# EAGLE design 1chMD (EAGLE 9.4.2)
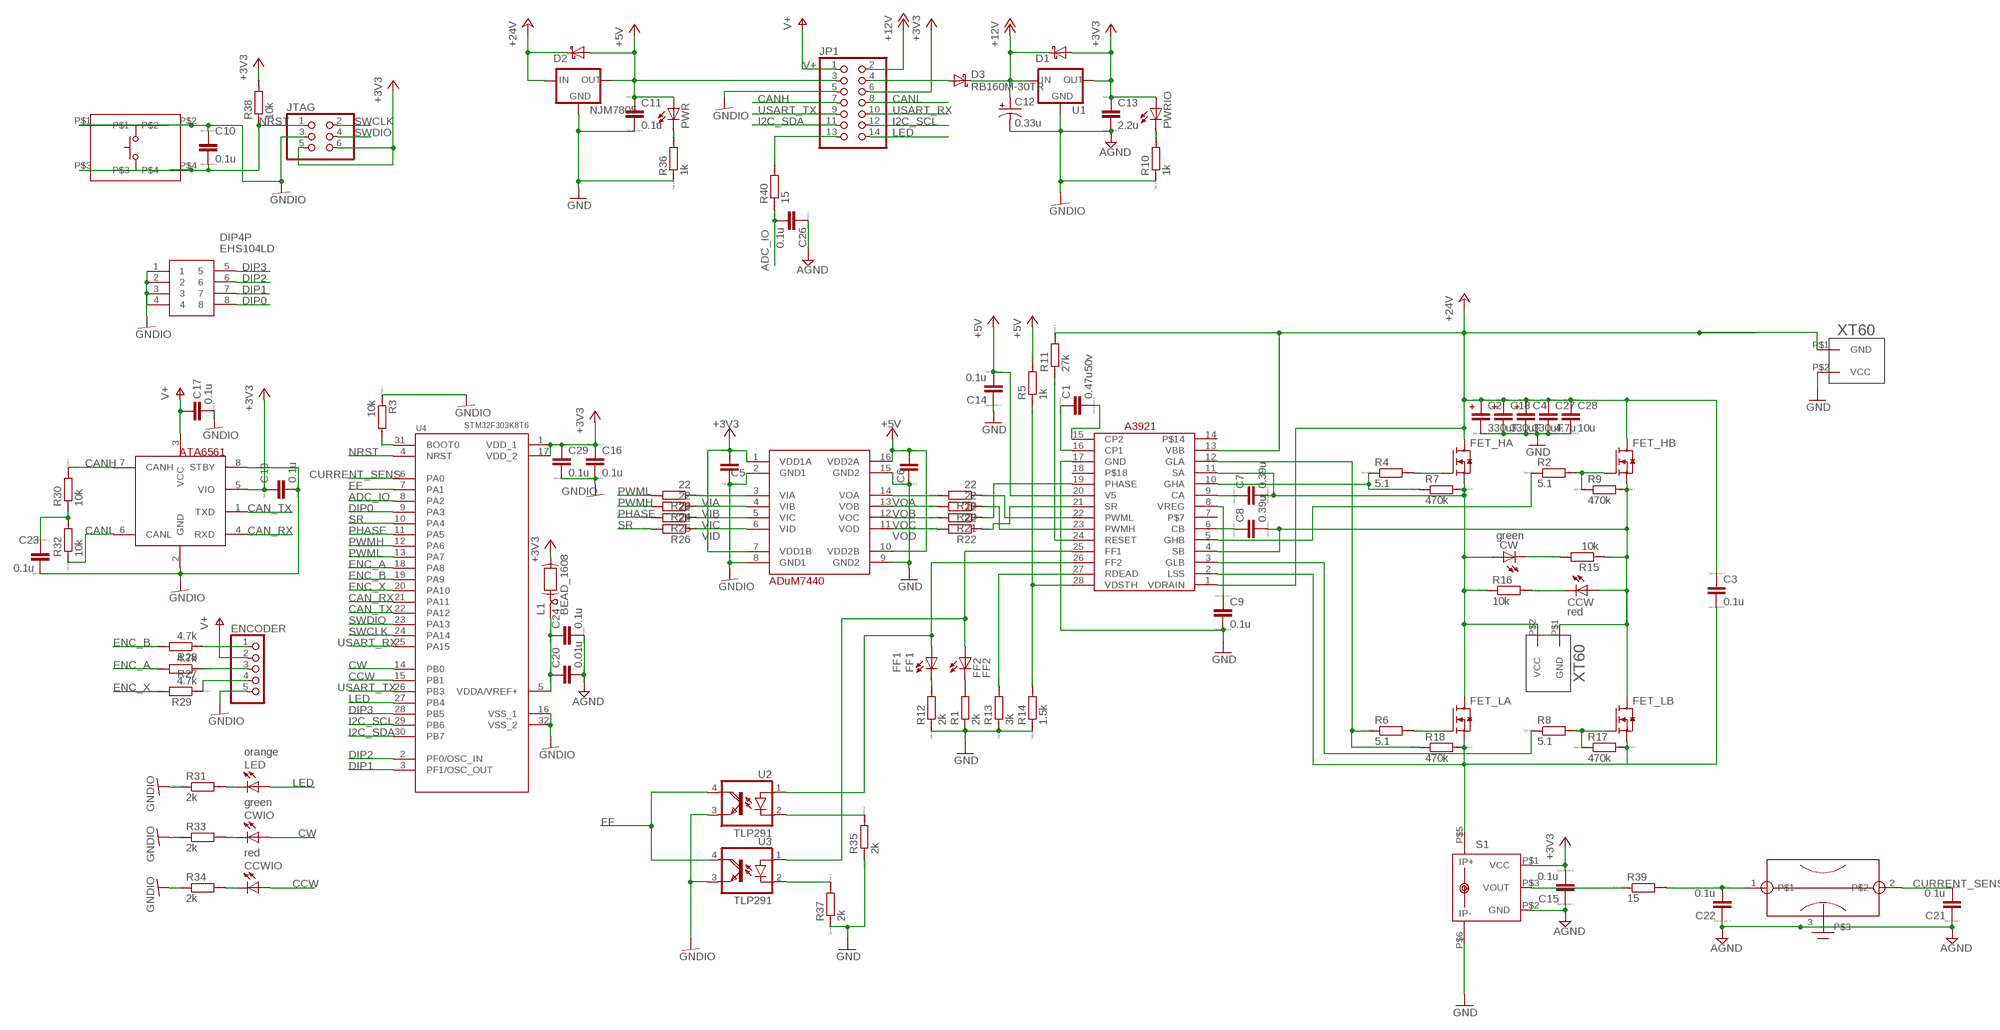
[diagram p0: schematic, sheet 1]

## Parts
A3921  A3921  [TSSOP28]
ADUM7440  ADUM7440  [QSOP16]
ATA6561  ATA6561  [SO_8]
C1  0.47u50v  C_1608  [1608]
C2  330uF  C_D10_SMD  [PANASONIC_G]
C3  0.1u  C_1608  [1608]
C4  330uF  C_D10_SMD  [PANASONIC_G]
C5  C_1608  [1608]
C6  C_1608  [1608]
C7  0.39u  C_1608  [1608]
C8  0.39u  C_1608  [1608]
C9  0.1u  C_1608  [1608]
C10  0.1u  C_1608  [1608]
C11  0.1u  C_1608  [1608]
C12  0.33u  CAP_POLC  [PANASONIC_C]
C13  2.2u  C_1608  [1608]
C14  0.1u  C_1608  [1608]
C15  0.1u  C_1608  [1608]
C16  0.1u  C_1608  [1608]
C17  0.1u  C_1608  [1608]
C18  330uF  C_D10_SMD  [PANASONIC_G]
C19  0.1u  C_1608  [1608]
C20  0.01u  C_1608  [1608]
C21  0.1u  C_1608  [1608]
C22  0.1u  C_1608  [1608]
C23  0.1u  C_1608  [1608]
C24  0.1u  C_1608  [1608]
C25  NFM18PS474R0J3D  [1608_EMIFIL]
C26  0.1u  C_1608  [1608]
C27  4.7u  C_2012  [C0805K]
C28  10u  C_3225  [C1210K]
C29  0.1u  C_1608  [1608]
CCW  red  LED_1608  [1608_POLE]
CCWIO  red  LED_1608  [1608_POLE]
CW  green  LED_1608  [1608_POLE]
CWIO  green  LED_1608  [1608_POLE]
D1  RB751S-40  [1608_POLE]
D2  RB751S-40  [1608_POLE]
D3  RB160M-30TR  [SODFL260X160X90L70X90N]
DIP4P  EHS104LD  [EHS104LD]
ENCODER  PINHD-1X5/90  [1X05/90]
FET_HA  FDBL86561_F085  [PG-HSOF-8-1]
FET_HB  FDBL86561_F085  [PG-HSOF-8-1]
FET_LA  FDBL86561_F085  [PG-HSOF-8-1]
FET_LB  FDBL86561_F085  [PG-HSOF-8-1]
FF1  FF1  LED_1608  [1608_POLE]
FF2  FF2  LED_1608  [1608_POLE]
JP1  PINHD-2X7/90  [2X07/90]
JTAG  PINHD-2X3/90  [2X03/90]
L1  BEAD_1608  [1608]
LED  orange  LED_1608  [1608_POLE]
NJM7805  NJM7805SDL1  [TO252]
P2  XT60-SMD  [XT60-ANGLED]
P4  XT60-SMD  [XT60-ANGLED]
PWR  LED_1608  [1608_POLE]
PWRIO  LED_1608  [1608_POLE]
R1  2k  R_1608  [1608]
R2  5.1  R_1608  [1608]
R3  10k  R_1608  [1608]
R4  5.1  R_1608  [1608]
R5  1k  R_1608  [1608]
R6  5.1  R_1608  [1608]
R7  470k  R_1608  [1608]
R8  5.1  R_1608  [1608]
R9  470k  R_1608  [1608]
R10  1k  R_1608  [1608]
R11  27k  R_1608  [1608]
R12  2k  R_1608  [1608]
R13  3k  R_1608  [1608]
R14  1.5k  R_1608  [1608]
R15  10k  R_1608  [1608]
R16  10k  R_1608  [1608]
R17  470k  R_1608  [1608]
R18  470k  R_1608  [1608]
R19  22  R_1608  [1608]
R20  22  R_1608  [1608]
R21  22  R_1608  [1608]
R22  22  R_1608  [1608]
R23  22  R_1608  [1608]
R24  22  R_1608  [1608]
R25  22  R_1608  [1608]
R26  22  R_1608  [1608]
R27  4.7k  R_1608  [1608]
R28  4.7k  R_1608  [1608]
R29  4.7k  R_1608  [1608]
R30  10k  R_1608  [1608]
R31  2k  R_1608  [1608]
R32  10k  R_1608  [1608]
R33  2k  R_1608  [1608]
R34  2k  R_1608  [1608]
R35  2k  R_1608  [1608]
R36  1k  R_1608  [1608]
R37  2k  R_1608  [1608]
R38  10k  R_1608  [1608]
R39  15  R_1608  [1608]
R40  15  R_1608  [1608]
S1  ACS781KLRTR-150U-T  [7-PIN_PSOF]
SW1  SKRPACE010  [SKRPACE010]
U1  NJM2845  [TO252]
U2  TLP291  [SOIC127P265X700X230-4N]
U3  TLP291  [SOIC127P265X700X230-4N]
U4  STM32F303K8T6  [QFP80P900X900X160-32N]

## Nets
+3V3: ADUM7440.1(VDD1A) ADUM7440.7(VDD1B) ATA6561.5(VIO) C5.1 C13.1 C15.2 C16.1 C19.1 C29.1 D1.2(A) JP1.6 JTAG.5 JTAG.6 L1.2 PWRIO.2(A) R38.2 S1.P$1(VCC) U1.2(OUT) U4.1(VDD_1) U4.17(VDD_2)
+5V: A3921.20(V5) ADUM7440.10(VDD2B) ADUM7440.16(VDD2A) C6.2 C11.1 C14.2 D2.2(A) JP1.3 NJM7805.2(OUT) PWR.2(A) R5.2
+12V: C12.+ D1.1(C) D3.2(C) JP1.2 U1.1(IN)
+24V: A3921.1(VDRAIN) A3921.13(VBB) C2.+ C3.1 C4.+ C18.+ C27.1 C28.1 D2.1(C) FET_HA.9(D) FET_HB.9(D) NJM7805.1(IN) P2.P$1(GND) R11.2
ADC_IO: C26.2 R40.1 U4.8(PA2)
AGND: C12.- C13.2 C15.1 C20.2 C21.1 C22.1 C24.2 C25.3 C26.1 R10.1 S1.P$2(GND) U1.3(GND) ; supply symbol labelled GNDIO
CAN_RX: ATA6561.4(RXD) U4.21(PA11)
CAN_TX: ATA6561.1(TXD) U4.22(PA12)
CANH: ATA6561.7(CANH) JP1.7 R30.2
CANL: ATA6561.6(CANL) JP1.8 R32.1
CCW: CCWIO.2(A) U4.15(PB1)
CURRENT_SENS: C21.2 C25.2 U4.6(PA0)
CW: CWIO.2(A) U4.14(PB0)
DIP0: DIP4P.8 U4.9(PA3)
DIP1: DIP4P.7 U4.3(PF1/OSC_OUT)
DIP2: DIP4P.6 U4.2(PF0/OSC_IN)
DIP3: DIP4P.5 U4.28(PB5)
ENC_A: R27.2 U4.18(PA8)
ENC_B: R28.2 U4.19(PA9)
ENC_X: R29.2 U4.20(PA10)
FF: U2.4(COL) U3.4(COL) U4.7(PA1)
GND: A3921.17(GND) ADUM7440.9(GND2) ADUM7440.15(GND2) C2.- C4.- C6.1 C9.2 C11.2 C14.1 C18.- C27.2 C28.2 NJM7805.3(GND) P2.P$2(VCC) R1.1 R12.1 R13.1 R14.1 R35.1 R36.1 R37.1 S1.P$6(IP-)
GNDIO: ADUM7440.2(GND1) ADUM7440.8(GND1) ATA6561.2(GND) ATA6561.8(STBY) C5.2 C10.1 C16.2 C17.2 C19.2 C23.2 C29.2 DIP4P.1 DIP4P.2 DIP4P.3 DIP4P.4 ENCODER.5 JP1.5 JTAG.3 R3.1 R31.1 R33.1 R34.1 SW1.P$1 SW1.P$2 U2.3(EMI) U3.3(EMI) U4.16(VSS_1) U4.32(VSS_2)
I2C_SCL: JP1.12 U4.29(PB6)
I2C_SDA: JP1.11 U4.30(PB7)
LED: JP1.14 LED.2(A) U4.27(PB4)
N$1: FET_HB.1(G) R2.2 R9.1
N$2: A3921.24(RESET) R11.1
N$3: FET_LB.1(G) R8.2 R17.1
N$5: A3921.8(VREG) C9.1
N$6: FET_LA.1(G) R6.2
N$7: FET_HA.1(G) R4.2
N$8: A3921.25(FF1) FF2.2(A) U3.1(A)
N$9: PWRIO.1(C) R10.2
N$10: PWR.1(C) R36.2
N$11: A3921.9(CA) C7.1
N$12: A3921.10(GHA) R4.1 R7.1
N$13: A3921.6(CB) C8.1
N$14: A3921.5(GHB) R2.1
N$15: A3921.12(GLA) R6.1 R18.1
N$16: A3921.3(GLB) R8.1
N$17: A3921.26(FF2) FF1.2(A) U2.1(A)
N$18: A3921.4(SB) C8.2 CCW.2(A) FET_HB.2-8(S) FET_LB.9(D) P4.P$1(GND) R9.2 R15.1
N$19: FF2.1(C) R1.2
N$20: FF1.1(C) R12.2
N$21: A3921.16(CP1) C1.1
N$22: A3921.15(CP2) C1.2
N$23: A3921.27(RDEAD) R13.2
N$24: A3921.22(PWML) R19.1
N$25: A3921.23(PWMH) R20.1
N$26: A3921.19(PHASE) R21.1
N$27: A3921.2(LSS) C3.2 FET_LA.2-8(S) FET_LB.2-8(S) R17.2 R18.2 S1.P$5(IP+)
N$28: A3921.28(VDSTH) R5.1 R14.2
N$29: A3921.21(SR) R22.1
N$32: CW.1(C) R15.2
N$33: CCW.1(C) R16.2
N$34: LED.1(C) R31.2
N$37: CWIO.1(C) R33.2
N$41: CCWIO.1(C) R34.2
N$43: ENCODER.3 R27.1
N$44: R3.2 U4.31(BOOT0)
N$45: R39.1 S1.P$3(VOUT)
N$46: R35.2 U2.2(C)
N$52: ENCODER.4 R29.1
N$56: ENCODER.1 R28.1
N$57: R37.2 U3.2(C)
N$61: JP1.13 R40.2
N$91: A3921.11(SA) C7.2 CW.2(A) FET_HA.2-8(S) FET_LA.9(D) P4.P$2(VCC) R7.2 R16.1
N$92: C23.1 R30.1 R32.2
N$111: D3.1(A) JP1.4
N$113: C20.1 C24.1 L1.1 U4.5(VDDA/VREF+)
NRST: C10.2 JTAG.1 R38.1 SW1.P$3 SW1.P$4 U4.4(NRST)
PHASE: R25.2 U4.11(PA5)
PWMH: R24.2 U4.12(PA6)
PWML: R23.2 U4.13(PA7)
SR: R26.2 U4.10(PA4)
SWCLK: JTAG.2 U4.24(PA14)
SWDIO: JTAG.4 U4.23(PA13)
USART_RX: JP1.10 U4.25(PA15)
USART_TX: JP1.9 U4.26(PB3)
V+: ATA6561.3(VCC) C17.1 ENCODER.2 JP1.1
VIA: ADUM7440.3(VIA) R23.1
VIB: ADUM7440.4(VIB) R24.1
VIC: ADUM7440.5(VIC) R25.1
VID: ADUM7440.6(VID) R26.1
VOA: ADUM7440.14(VOA) R19.2
VOB: ADUM7440.13(VOB) R20.2
VOC: ADUM7440.12(VOC) R21.2
VOD: ADUM7440.11(VOD) R22.2
VOUT: C22.2 C25.1 R39.2
Unconnected: A3921.7 A3921.14 A3921.18

## Library data of the parts
A3921 = mylib:A3921
ADUM7440 = mylib:ADUM7440
ATA6561 = mylib:ATA6561
C1 C3 C5-C11 C13-C17 C19 C20 C22-C24 C26 C29 = mylib:C_1608
C2 C4 C18 = mylib:C_D10_SMD
C12 = asl_cap:CAP_POL: Capacitor Polarized These are standard SMD and PTH capacitors. Normally 10uF, 47uF, and 100uF in electrolytic and tantalum varieties. Always verify the external diameter of the through hole cap, it varies with capacity, voltage, and manufacturer. The EIA devices should be standard.
C21 = mylib:C_1608; SPICEPREFIX: C
C25 = mylib:NFM18PS474R0J3D
C27 = mylib:C_2012
C28 = mylib:C_3225
CCW CCWIO CW CWIO FF1 FF2 LED PWR PWRIO = mylib:LED_1608
D1 D2 = mylib:RB751S-40
D3 = mylib:RB160M-30TR
DIP4P = EHS104LD:EHS104LD: 4 Position DIP Switch Source: Datasheet <http://akizukidenshi.com/download/ds/excelcell/ehs.pdf>; DESCRIPTION: 4 Position DIP Switch; HEIGHT: 1mm; MANUFACTURER_NAME: ECE; MANUFACTURER_PART_NUMBER: EHS104LD
ENCODER = pinhead:PINHD-1X5: PIN HEADER
FET_HA FET_HB FET_LA FET_LB = mylib:FDBL86561_F085
JP1 = pinhead:PINHD-2X7: PIN HEADER
JTAG = pinhead:PINHD-2X3: PIN HEADER
L1 = mylib:BEAD_1608
NJM7805 = mylib:NJM7805SDL1
P2 P4 = mylib:XT60-SMD
R1-R40 = mylib:R_1608
S1 = mylib:ACS781KLRTR-150U-T
SW1 = mylib:SKRPACE010
U1 = mylib:NJM2845
U2 U3 = mylib:TLP291
U4 = mylib:STM32F303K8T6

## Board
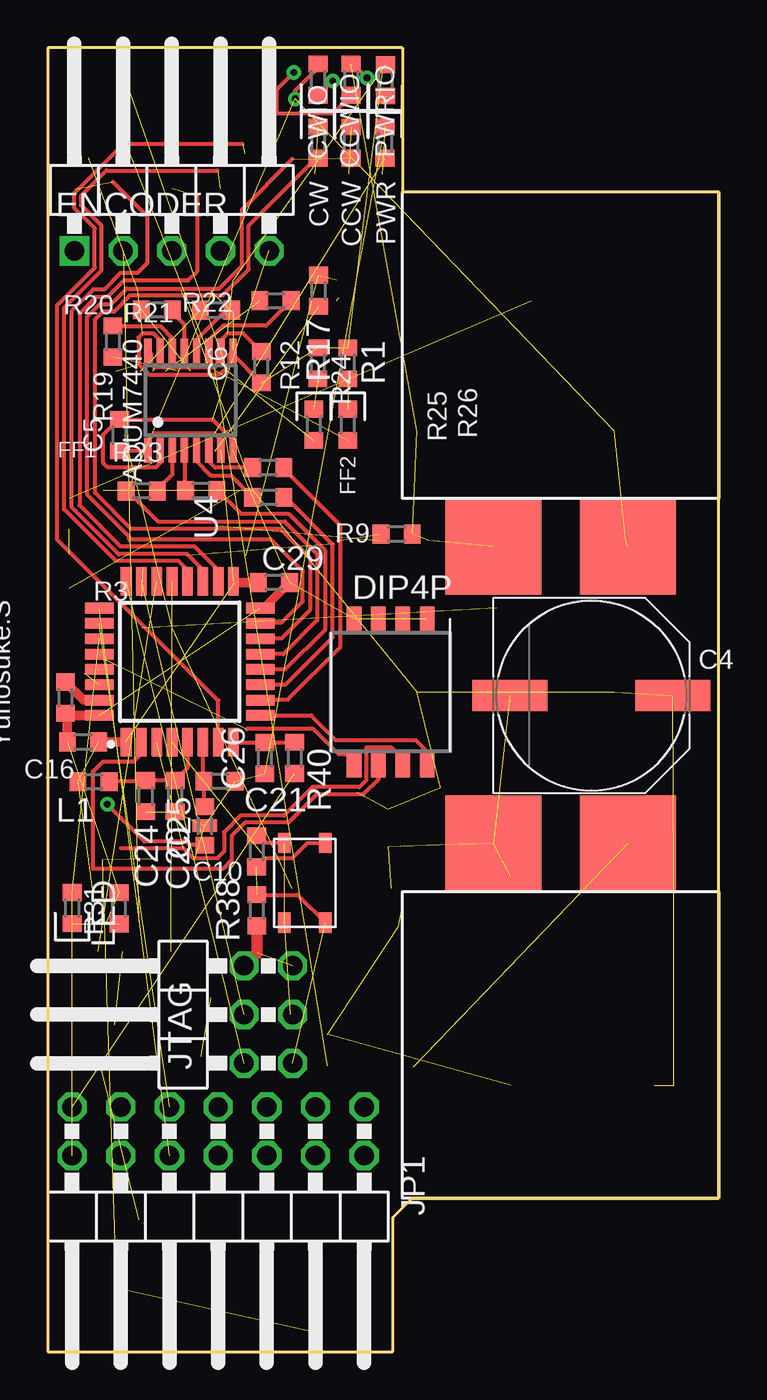
[diagram p1: board, top side]
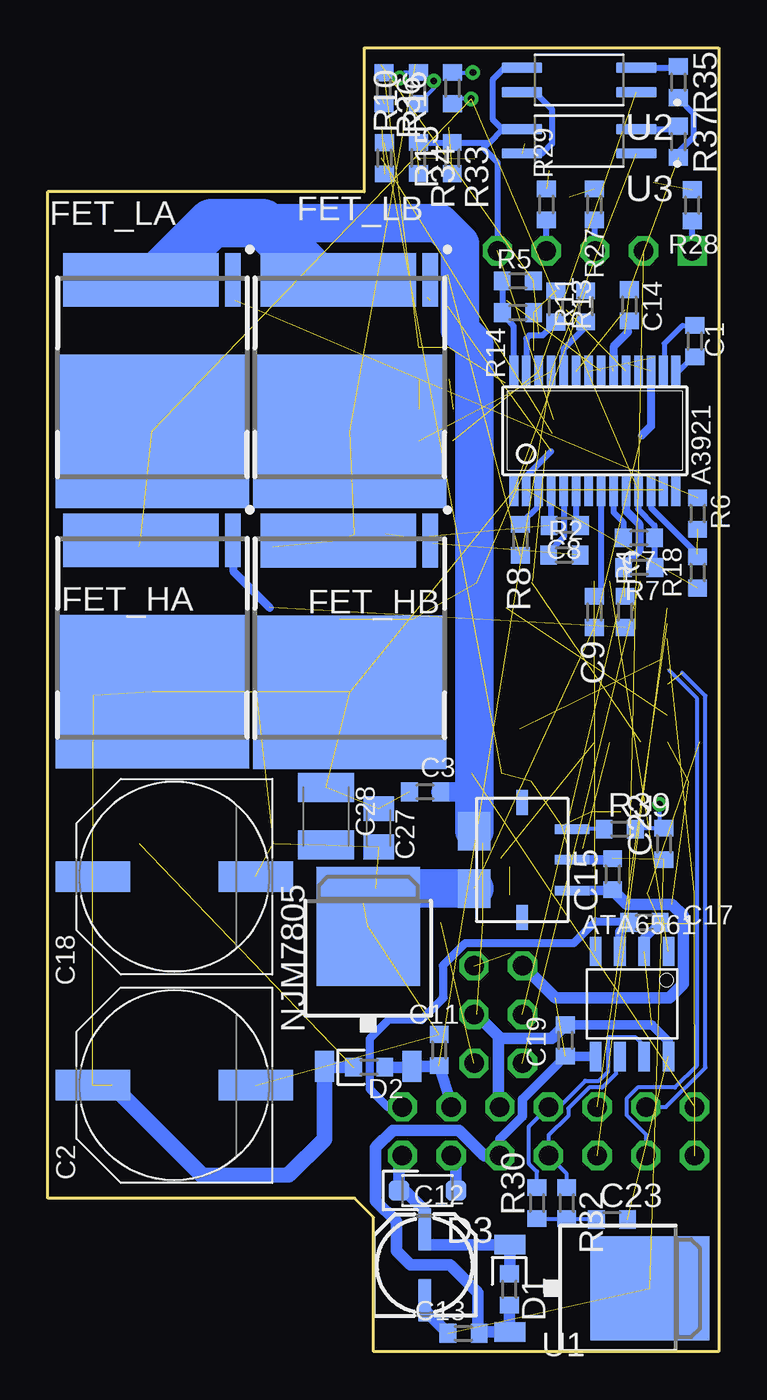
[diagram p2: board, bottom side, seen from below]

Size 35 x 68 mm. Coordinates in mm from the lower left corner, seen from the top.
Outline: 0,0 18,0 18,7 19,8 35,8 35,60.5 18.5,60.5 18.5,68 0,68 0,0
Copper layers (1*16): Top 0.035mm / dielectric 1.5mm / Bottom 0.035mm
Design rules "default *": minimum track width 8mil, minimum drill 0.3mm, track to track 6mil, track to pad 6mil, pad to pad 6mil, via to via 6mil, smd to smd 6mil, copper to edge 12mil, drill to drill 8mil, minimum pad ring 10mil, minimum via ring 8mil, stop-mask expansion 4mil, vias tented up to drill 0mil, thermal gap 10mil

### Footprints (pad centres in the part's own frame; a part is rotated, then mirrored left to right if it is on the bottom)
TSSOP28 = smd 0.45 x 1.65: 1 -4.225,-3.1; 2 -3.575,-3.1; 3 -2.925,-3.1; 4 -2.275,-3.1; 5 -1.625,-3.1; 6 -0.975,-3.1; 7 -0.325,-3.1; 8 0.325,-3.1; 9 0.975,-3.1; 10 1.625,-3.1; 11 2.275,-3.1; 12 2.925,-3.1; 13 3.575,-3.1; 14 4.225,-3.1; 15 4.225,3.1; 16 3.575,3.1; 17 2.925,3.1; 18 2.275,3.1; 19 1.625,3.1; 20 0.975,3.1; 21 0.325,3.1; 22 -0.325,3.1; 23 -0.975,3.1; 24 -1.625,3.1; 25 -2.275,3.1; 26 -2.925,3.1; 27 -3.575,3.1; 28 -4.225,3.1
QSOP16 = smd 0.381 x 1.27: 1 -2.223,-2.6; 2 -1.587,-2.6; 3 -0.953,-2.6; 4 -0.318,-2.6; 5 0.318,-2.6; 6 0.953,-2.6; 7 1.587,-2.6; 8 2.223,-2.6; 9 2.223,2.6; 10 1.587,2.6; 11 0.953,2.6; 12 0.318,2.6; 13 -0.318,2.6; 14 -0.953,2.6; 15 -1.587,2.6; 16 -2.223,2.6
SO_8 = smd 0.61 x 1.524: 1 -1.905,-2.743; 2 -0.635,-2.743; 3 0.635,-2.743; 4 1.905,-2.743; 5 1.905,2.743; 6 0.635,2.743; 7 -0.635,2.743; 8 -1.905,2.743
1608 = smd 0.87 x 0.98: 1 -0.815,0; 2 0.815,0
PANASONIC_G = smd 3.9 x 1.6: + 4.25,0; - -4.25,0
PANASONIC_C = smd 2.2 x 0.65: + 1.9,-0.2; - -1.8,-0.2
1608_EMIFIL = smd 0.87 x 0.98: 1 -1,0; 2 1,0 | smd 0.65 x 1.3: 3 0,0
C0805K = smd 1.3 x 1.6: 1 -1,0; 2 1,0
C1210K = smd 1.5 x 2.9: 1 -1.5,0; 2 1.5,0
1608_POLE = smd 0.87 x 0.98: 1 -0.815,0; 2 0.815,0
SODFL260X160X90L70X90N = smd 1.07 x 1.03: 1 -1.485,0; 2 1.485,0
EHS104LD = smd 0.76 x 1.3: 1 -5.08,0.01; 2 -3.81,0.01; 3 -2.54,0.01; 4 -1.27,0.01; 5 -1.27,7.61; 6 -2.54,7.61; 7 -3.81,7.61; 8 -5.08,7.61
1X05/90 = drill 1.016 square: 1 -5.08,-3.81 | drill 1.016 octagon: 2 -2.54,-3.81; 3 0,-3.81; 4 2.54,-3.81; 5 5.08,-3.81
PG-HSOF-8-1 = smd 0.8 x 2.8: 1 0.75,0.098 | smd 8.1 x 2.8: 2-8 5.55,0.098 | smd 10.1 x 8: 9 4.95,7.998
2X07/90 = drill 1.016 octagon: 1 -7.62,-6.35; 2 -7.62,-3.81; 3 -5.08,-6.35; 4 -5.08,-3.81; 5 -2.54,-6.35; 6 -2.54,-3.81; 7 0,-6.35; 8 0,-3.81; 9 2.54,-6.35; 10 2.54,-3.81; 11 5.08,-6.35; 12 5.08,-3.81; 13 7.62,-6.35; 14 7.62,-3.81
2X03/90 = drill 1.016 octagon: 1 -2.54,-6.35; 2 -2.54,-3.81; 3 0,-6.35; 4 0,-3.81; 5 2.54,-6.35; 6 2.54,-3.81
TO252 = smd 1 x 1.6: 1 -2.28,-6.07; 2 2.28,-6.07 | smd 5.4 x 6.2: 3 0,1.23
XT60-ANGLED = smd 5 x 5: P$1 -3.5,-18.5; P$2 3.5,-18.5
7-PIN_PSOF = smd 0.5 x 1.8: P$1 -1.6,-2.6; P$2 0,-2.6; P$3 1.6,-2.6 | smd 1.3 x 0.6: P$4 3,0; P$7 -3,0 | smd 2 x 1.7: P$5 1.5,2.5; P$6 -1.5,2.5
SKRPACE010 = smd 1.05 x 0.65: P$1 -2.075,1.075; P$2 2.075,1.075; P$3 -2.075,-1.075; P$4 2.075,-1.075
SOIC127P265X700X230-4N = smd 2.13 x 0.54: 1 -2.99,0.635; 2 -2.99,-0.635; 3 2.99,-0.635; 4 2.99,0.635
QFP80P900X900X160-32N = smd 1.5 x 0.55: 1 -4.2,2.8; 2 -4.2,2; 3 -4.2,1.2; 4 -4.2,0.4; 5 -4.2,-0.4; 6 -4.2,-1.2; 7 -4.2,-2; 8 -4.2,-2.8; 17 4.2,-2.8; 18 4.2,-2; 19 4.2,-1.2; 20 4.2,-0.4; 21 4.2,0.4; 22 4.2,1.2; 23 4.2,2; 24 4.2,2.8 | smd 0.55 x 1.5: 9 -2.8,-4.2; 10 -2,-4.2; 11 -1.2,-4.2; 12 -0.4,-4.2; 13 0.4,-4.2; 14 1.2,-4.2; 15 2,-4.2; 16 2.8,-4.2; 25 2.8,4.2; 26 2,4.2; 27 1.2,4.2; 28 0.4,4.2; 29 -0.4,4.2; 30 -1.2,4.2; 31 -2,4.2; 32 -2.8,4.2

### Placement (x,y rotation side)
A3921  6.46,48.04 0 bottom
ADUM7440  7.44,49.61 0 top
ATA6561  4.52,18.13 180 bottom
C1  1.25,52.71 270 bottom
C2  28.4,13.89 180 bottom
C3  15.32,29.2 0 bottom
C4  28.35,34.22 0 top
C5  3.74,47.81 90 top
C6  11.13,51.34 90 top
C7  4.16,42.44 0 bottom
C8  8.03,43.09 180 bottom
C9  6.49,38.58 270 bottom
C10  10.89,26.09 270 top
C11  14.59,15.73 90 bottom
C12  15.53,4.47 90 bottom
C13  13.31,0.95 180 bottom
C14  4.66,54.58 270 bottom
C15  5.54,24.9 270 bottom
C16  1.83,31.8 180 top
C17  3.87,22.39 0 bottom
C18  28.4,24.77 180 bottom
C19  8,16.22 90 bottom
C20  6.63,28.97 270 top
C21  8.95,29.75 180 top
C22  2.86,26.48 90 bottom
C23  5.57,6.88 0 bottom
C24  5.1,28.97 270 top
C25  8.19,27.42 90 top
C26  11.32,30.96 90 top
C27  17.74,27.32 270 bottom
C28  20.49,27.92 270 bottom
C29  11.79,40.12 0 top
CCW  15.82,66.34 90 top
CCWIO  15.82,63.06 270 top
CW  14.1,66.35 90 top
CWIO  14.1,63.06 270 top
D1  10.93,3.24 270 bottom
D2  18.24,14.83 0 bottom
D3  15.21,8.41 180 bottom
DIP4P  14.7,38.21 180 top
ENCODER  6.46,61.23 0 top
FET_HA  24.6,42.41 180 bottom
FET_HB  14.3,42.4 180 bottom
FET_LA  24.6,56 180 bottom
FET_LB  14.3,56 180 bottom
FF1  13.87,48.35 270 top
FF2  15.65,48.35 270 top
JP1  8.88,6.41 180 top
JTAG  6.42,17.58 90 top
L1  2.39,29.73 180 top
LED  1.26,23.13 90 top
NJM7805  18.29,20.94 0 bottom
P2  26.75,8 180 top
P4  26.75,60.5 0 top
PWR  17.61,66.31 90 top
PWRIO  17.59,63.07 270 top
R1  15.65,51.55 270 top
R2  8.05,41.54 0 bottom
R3  0.91,34.11 90 top
R4  4.89,38.58 270 bottom
R5  10.48,55.85 0 bottom
R6  1.1,43.71 90 bottom
R7  4.14,40.9 0 bottom
R8  10.35,42.34 270 bottom
R9  18.2,42.64 0 top
R10  17.44,62.24 270 bottom
R11  6.94,54.52 90 bottom
R12  14.09,51.55 270 top
R13  8.49,54.51 270 bottom
R14  10.47,54.19 180 bottom
R15  15.67,65.91 270 bottom
R16  13.89,65.91 90 bottom
R17  14.12,55.33 270 top
R18  1.11,40.64 270 bottom
R19  3.4,52.69 90 top
R20  5.69,54.34 0 top
R21  8.78,54.33 0 top
R22  11.88,54.81 0 top
R23  4.89,44.89 180 top
R24  8,44.91 0 top
R25  11.5,44.56 0 top
R26  11.5,46.11 0 top
R27  6.49,59.84 90 bottom
R28  1.39,59.79 90 bottom
R29  8.99,59.84 90 bottom
R30  9.48,7.75 90 bottom
R31  3.71,23.12 270 top
R32  7.93,7.75 270 bottom
R33  13.91,62.25 270 bottom
R34  15.67,62.26 270 bottom
R35  2.11,66.22 90 bottom
R36  17.47,65.9 270 bottom
R37  2.11,63.1 90 bottom
R38  10.9,23.01 270 top
R39  5.16,27.25 0 bottom
R40  12.87,30.97 270 top
S1  10.25,25.65 90 bottom
SW1  13.4,24.45 90 top
U1  4.83,3.3 270 bottom
U2  7.28,66.33 180 bottom
U3  7.28,63.13 180 bottom
U4  6.88,35.98 90 top

### Tracks (layer width: path | path; a pad name or v marks a point on that pad's centre or on a via)
+3V3  (7 unrouted)
  Top 0.203: C5.1 3.75,47.01 ADUM7440.1 5.16,47.07 5.16,47.5 5.56,47.9 8.69,47.9 9.04,47.55 ADUM7440.7
  Top 0.508: C29.1 9.75,40.12 U4.17 | C16.1 4.07,31.8 U4.1
  Top 0.61: R38.2 10.9,20.79 JTAG.6
  Bottom 0.508: ATA6561.5 6.45,15.41 C19.1 10.25,13.16 10.25,12.27 11.42,11.11 JP1.6 | S1.P$1 5.58,24.05 C15.2
  Bottom 0.61: D1.2 10.93,1.05 U1.2 12.43,1.02 C13.1 12.55,1 12.55,3.06 14.02,4.53 16.07,4.53 16.81,5.27 16.81,6.78 17.9,7.87 17.9,10.64 17,11.54 13.55,11.54 12.24,10.22 JP1.6 | C15.2 4.79,23.34 2.44,23.34 1.86,22.76 1.86,19.17 2.57,18.45 8.52,18.45 10.19,20.12 JTAG.6
+5V  (4 unrouted)
  Top 0.203: C6.2 10.19,53.1 9.37,53.1 9.03,52.76 ADUM7440.10 8.84,52.02 8.84,51.47 8.69,51.32 5.56,51.32 5.41,51.47 5.41,52.02 ADUM7440.16
  Bottom 0.305: C14.2 4.72,53.71 4.72,53.2
  Bottom 0.406: A3921.20 5.47,51.16 5.47,52.45 4.72,53.2
  Bottom 0.61: D2.2 16.05,14.83 NJM7805.2 14.59,14.88 C11.1 13.96,13.01 JP1.3
+12V
  Bottom 0.61: D1.1 10.9,4.09 U1.1 15.24,5.58 15.33,5.67 C12.+ 15.33,7.33 16.41,8.4 D3.2 16.69,10.03 JP1.2
+24V  (12 unrouted)
  Bottom 0.61: NJM7805.1 20.53,14.83 D2.1
  Bottom 0.813: 31.65,13.89 26.96,9.2 22.44,9.21 20.57,11.07 NJM7805.1
ADC_IO
  Top 0.203: U4.8 C26.2 R40.1
AGND  (9 unrouted)
  Bottom 0.203: 5.61,25.65 C15.1
  Bottom 0.508: S1.P$2 5.61,25.65
  Bottom 0.61: C13.2 15.33,2.16 C12.-
CAN_RX  (1 unrouted)
CAN_TX  (1 unrouted)
CANH
  Bottom 0.203: ATA6561.7 3.89,15.94 4.35,16.4 5.77,16.4 5.77,14.61 6.25,14.13 6.96,14.13 8.27,12.82 8.82,12.82 JP1.7 9.9,11.74 9.9,9.8 9.48,9.38 R30.2
CANL
  Bottom 0.203: R32.1 7.93,9.27 JP1.8 8.88,11.27 7.86,12.29 7.86,12.68 6.76,13.77 6.08,13.77 5.36,14.49 5.36,15.19 ATA6561.6
CCW  (1 unrouted)
  Top 0.203: U4.15 11.1,38.01 12.17,38.01 13.29,39.12 13.29,40.71 11.65,42.36 4.25,42.36 4.25,42.5 2.05,44.7 2.05,53.99 2.68,54.62 3.27,54.62 4.1,55.45 8.93,55.45 10.12,56.64 10.12,59.57 12.75,62.2
CURRENT_SENS
  Top 0.203: U4.6 8.08,29.8 C21.2 8.13,28.48 C25.2
CW
  Top 0.203: U4.14 11.1,37.2 12.19,37.2 13.69,38.71 13.69,41.36 12.15,42.91 4.35,42.91 2.46,44.8 2.46,53.84 2.86,54.24 3.45,54.24 4.3,55.09 9.13,55.09 10.48,56.45 10.48,58.73 13.99,62.25 CWIO.2
DIP0
  Top 0.203: DIP4P.8 19.78,31.3 19.2,31.88 15.03,31.88 13.73,33.18 U4.9
DIP1  (1 unrouted)
  Top 0.203: DIP4P.7 18.51,30.92 17.93,31.51 16.61,31.51 16.61,29.8 16.26,29.45 13.81,29.45 12.31,27.95 10.05,27.95 9.19,27.09 9.19,26.09 8.83,25.73 7.59,25.73 7.08,26.25 3.8,26.25
DIP2
  Top 0.203: DIP4P.6 17.24,29.85 16.44,29.05 14.01,29.05 12.55,27.6 10.3,27.6 9.59,26.89 9.59,25.64 9.13,25.18 2.36,25.18 2.36,30.26 2.88,30.78 4.46,30.78 4.86,31.18 4.86,31.76 U4.2
DIP3  (1 unrouted)
  Top 0.203: 2.95,36.11 U4.28 | DIP4P.5 15.97,30.9 15.72,31.15 15.19,31.15 13.87,32.47 10.38,32.47
ENC_A  (1 unrouted)
  Top 0.203: U4.18 8.86,40.2 8.86,40.79 7.65,42 3.8,42 1.65,44.15 1.65,54.15 2.5,55 3.1,55 3.95,55.85 7.29,55.85 7.8,56.36 7.8,60.25
ENC_B  (1 unrouted)
  Top 0.203: U4.19 8.11,40.21 8.11,40.74 7.26,41.59 3.7,41.59 1.25,44.05 1.25,54.3 2.35,55.4 2.92,55.4 3.8,56.27 4.67,56.27 5.2,56.8 5.2,59.2 3.4,61
ENC_X  (1 unrouted)
  Top 0.203: U4.20 7.21,40.26 7.21,40.84 6.81,41.24 3.56,41.24 0.85,43.94 0.85,54.45 2.8,56.4 2.8,58.73 1.73,59.8 1.73,60.28 3.05,61.6 8.85,61.6
FF  (1 unrouted)
  Top 0.203: U4.7 8.88,33.97 0.48,42.37 0.48,54.59 2.44,56.55 2.44,58.59 1.38,59.65 1.38,60.43 3.95,63 10.15,63
  Bottom 0.305: U2.4 9.6,65.69 8.7,64.8 8.7,63 9.21,62.49 U3.4
GND  (18 unrouted)
  Top 0.203: ADUM7440.15 5.76,52.3 5.76,52.84 5.51,53.09 4.92,53.09 4.72,52.9 4.72,51.52 5.28,50.96 8.97,50.96 9.47,51.47 9.47,52.02 ADUM7440.9 9.66,51.99 C6.1
  Bottom 0.305: R37.1 2.11,62.56 1.31,63.35 1.31,64.61 R35.1
  Bottom 0.406: 4,47.8 3.54,48.26 A3921.17
  Bottom 2: S1.P$6 17.9,24.15 18.55,23.5
GNDIO  (13 unrouted)
  Top 0.203: ADUM7440.2 5.86,47 5.86,46.37 5.61,46.12 3.13,46.12 2.89,46.35 2.89,47.83 3.68,48.62 C5.2 8.6,48.62 9.67,47.55 9.67,47.02 ADUM7440.8 | SW1.P$2 11.27,26.52 C10.1
  Top 0.508: U4.16 11.27,38.78 C29.2 | U4.32 1.03,33.18 R3.1 1.02,33.19 C16.2
  Bottom 0.305: U2.3 11.17,66.97 11.8,66.34 11.8,64.29 11.27,63.77 | U3.3 11.27,63.77 | R34.1 15.66,63.07 R33.1 11.97,63.07 | 11.97,63.07 12.27,62.77 11.64,62.14 11.54,62.03 ENCODER.5 | 11.97,63.07 11.27,63.77
  Bottom 0.508: C17.2 3.89,21.56 ATA6561.2 | C19.2 3.49,17.04 2.62,16.17 ATA6561.8
  Bottom 0.61: JP1.5 11.5,12.84 11.5,16.34 | 11.5,16.34 11.5,16.44 12.64,17.58 JTAG.3 12.85,17.58 | 11.5,16.34 8.69,16.34 C19.2
I2C_SCL  (1 unrouted)
  Bottom 0.203: JP1.12 3.8,11.32 4.82,12.34 4.82,13.18 4.22,13.77 2.29,13.77 1.15,14.91 1.15,34.1 2.57,35.52
I2C_SDA  (1 unrouted)
  Bottom 0.203: JP1.11 2.75,12.76 0.7,14.81 0.7,34.2 1.9,35.4
LED  (2 unrouted)
N$1  (2 unrouted)
  Bottom 0.305: FET_HB.1 14.9,42.16
N$2
  Bottom 0.305: A3921.24 8.09,52.31 6.94,53.45 R11.1
N$3  (3 unrouted)
  Bottom 0.508: 15.2,56.4 15.2,54.97 | FET_LB.1 15.05,54.82
N$5
  Bottom 0.305: A3921.8 6.16,44.92 6.16,39.4 C9.1
N$6  (1 unrouted)
  Bottom 0.305: 25.25,54.82 25.23,54.82 25.35,54.94 FET_LA.1
N$7  (1 unrouted)
  Bottom 0.406: 23.43,38.8 25.3,40.68 25.3,42.27 FET_HA.1
N$8  (2 unrouted)
N$9  (1 unrouted)
N$10  (1 unrouted)
N$11
  Bottom 0.305: A3921.9 5.49,43.79 4.98,43.27 C7.1
N$12  (1 unrouted)
  Bottom 0.406: A3921.10 4.84,43.86 4.15,43.17 4.15,41.76 4.96,41.05 R7.1
N$13
  Bottom 0.305: A3921.6 7.46,44.92 7.46,43.09 C8.1
N$14
  Bottom 0.305: A3921.5 8.08,42.48 8.87,41.69 R2.1
N$15  (1 unrouted)
  Bottom 0.305: A3921.12 3.54,44.03 1.11,41.6 R18.1
N$16
  Bottom 0.305: R8.1 10.33,43.16 9.39,44.1 A3921.3
N$17  (2 unrouted)
N$18  (via drill 0.35)  (5 unrouted)
  Top 0.203: CCW.2 15.93,67.16 v16.65,66.44
  Bottom 0.203: v16.65,66.44 16.37,66.72 R15.1
  Bottom 0.305: A3921.4 8.76,44.92 8.76,43.09 C8.2 | 17.35,42.3 FET_HB.2-8
N$19  (1 unrouted)
N$20  (1 unrouted)
N$21
  Bottom 0.254: A3921.16 2.84,51.18 2.84,52.58 1.9,53.52 C1.1
N$22
  Bottom 0.254: C1.2 1.33,51.89 2.09,51.14 A3921.15
N$23
  Bottom 0.305: R13.2 9.2,53 9.88,53 10.04,52.84 A3921.27
N$24  (1 unrouted)
N$25  (1 unrouted)
N$26  (1 unrouted)
N$27  (3 unrouted)
  Bottom 0.305: A3921.2 10.06,44.96 10.06,45.64 8.73,46.97
  Bottom 0.508: FET_LB.2-8 17.76,55.9
  Bottom 1.016: C3.2 12.8,29.2 12.75,29.25
  Bottom 2: 23.8,58.85 14.57,58.85 13.5,57.78 13.5,53.28 12.75,52.53 12.75,29.25 S1.P$5
  Bottom 2.54: FET_LA.2-8 29.41,55.9 26.46,58.85 23.8,58.85 20.86,55.9 FET_LB.2-8
N$28
  Bottom 0.305: A3921.28 10.69,53.47 R14.2 11.29,54.2 R5.1
N$29  (1 unrouted)
N$32  (via drill 0.35)
  Top 0.203: v14.87,66.28 14.84,66.28 CW.1
  Bottom 0.203: R15.2 14.87,65.9 v14.87,66.28
N$33  (via drill 0.35)
  Top 0.203: v12.83,66.71 11.93,65.81 11.93,64.58 14.87,64.58 CCW.1
  Bottom 0.203: R16.2 v12.83,66.71
N$34  (1 unrouted)
N$37  (1 unrouted)
N$41  (1 unrouted)
N$43
  Bottom 0.305: ENCODER.3 6.46,58.99 R27.1
N$44
  Top 0.508: U4.31 1.86,33.98 R3.2
N$45
  Bottom 0.203: R39.1 S1.P$3
N$46
  Bottom 0.305: U2.2 2.18,66.97 R35.2
N$52
  Bottom 0.305: ENCODER.4 R29.1
N$56
  Bottom 0.305: ENCODER.1 R28.1
N$57
  Bottom 0.305: U3.2 2.26,63.77 R37.2
N$61  (1 unrouted)
N$91  (via drill 0.35)  (4 unrouted)
  Top 0.203: CW.2 14.1,66.97 12.91,65.78 v12.91,65.35
  Bottom 0.203: v12.91,65.35 13.63,65.35 R16.1
  Bottom 0.305: A3921.11 4.2,44.92 4.2,43.95 3.35,43.1 C7.2 3.35,40.92 R7.2
N$92
  Bottom 0.203: R30.1 R32.2 6.43,6.93 C23.1
N$111
  Bottom 0.61: D3.1 13.72,9.98 JP1.4
N$113
  Top 0.203: U4.5 7.28,30.44 C20.1 C24.1 5.04,29.73 L1.1
NRST  (3 unrouted)
  Top 0.203: C10.2 11.36,25.75 12.76,25.75 13.54,26.52 SW1.P$4 | R38.1 13.03,23.83 SW1.P$3
PHASE
  Top 0.203: R25.2 12.31,44.46 12.37,44.41 12.55,44.41 14.86,42.1 14.86,37.25 12.41,34.8 11.1,34.8 U4.11
PWMH
  Top 0.203: R24.2 8.86,44.91 10.07,43.7 12.55,43.7 14.45,41.8 14.45,37.65 12.38,35.58 U4.12
PWML
  Top 0.203: R23.2 4.5,44.56 5.75,43.3 12.35,43.3 14.05,41.6 14.05,38.15 12.28,36.38 U4.13
SR
  Top 0.203: U4.10 11.1,34.01 12.51,34.01 15.26,36.76 15.26,43.09 12.31,46.04 R26.2
SWCLK  (1 unrouted)
SWDIO  (1 unrouted)
USART_RX  (1 unrouted)
USART_TX  (1 unrouted)
V+  (1 unrouted)
  Bottom 0.406: JP1.1 17.27,12.76 18.21,13.7 18.21,16.32 17.24,17.29 15.51,17.29 14.35,18.45 14.39,18.49 14.39,20.14 13.24,21.3 7.57,21.3 6.43,22.44 4.74,22.44 C17.1
  Bottom 0.508: C17.1 5.16,21.92 ATA6561.3
VIA
  Top 0.203: ADUM7440.3 6.49,45.76 5.71,44.98 R23.1
VIB
  Top 0.203: ADUM7440.4 7.12,44.85 R24.1
VIC
  Top 0.203: ADUM7440.5 7.75,46.44 8.5,45.7 9.55,45.7 R25.1
VID
  Top 0.203: R26.1 8.73,46.11 8.39,46.45 ADUM7440.6
VOA
  Top 0.203: ADUM7440.14 6.49,52.86 5.9,53.45 3.45,53.45 R19.2
VOB
  Top 0.203: R20.2 6.5,54.18 7.12,53.56 ADUM7440.13
VOC
  Top 0.203: R21.2 9.29,54.33 7.76,52.8 ADUM7440.12
VOD
  Top 0.203: R22.2 11.38,53.51 9.14,53.51 8.39,52.76 ADUM7440.11
VOUT  (via drill 0.35)
  Top 0.203: C25.1 7.41,26.42 7.22,26.61 5.04,26.61 v3.09,28.55
  Bottom 0.203: 3.13,28.59 v3.09,28.55 3.09,27.53 C22.2 4.31,27.29 R39.2

### Text on the board
tNames: 2019/10/31 / MD_V02.00 / Yunosuke.S